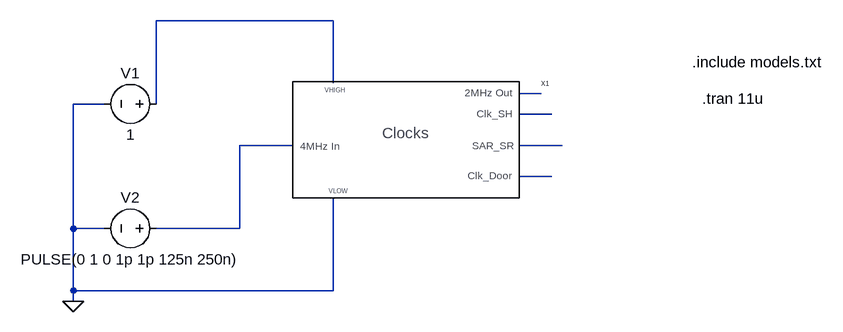
[diagram p0: schematic clocks_test.asc]
clocks_test.asc, the LTspice schematic file:
Version 4
SHEET 1 888 680
WIRE 112 16 -160 16
WIRE 112 112 112 16
WIRE 432 128 400 128
WIRE -240 144 -288 144
WIRE -160 144 -160 16
WIRE 448 160 400 160
WIRE 48 208 -32 208
WIRE 464 208 400 208
WIRE 448 256 400 256
WIRE -288 336 -288 144
WIRE -240 336 -288 336
WIRE -32 336 -32 208
WIRE -32 336 -160 336
WIRE -288 432 -288 336
WIRE 112 432 112 288
WIRE 112 432 -288 432
WIRE -288 448 -288 432
FLAG -288 448 0
SYMBOL Clock_half 160 176 R0
SYMATTR InstName X1
SYMBOL voltage -144 144 R90
WINDOW 0 -32 56 VBottom 2
WINDOW 3 32 56 VTop 2
WINDOW 123 0 0 Left 0
WINDOW 39 0 0 Left 0
SYMATTR InstName V1
SYMATTR Value 1
SYMBOL voltage -144 336 R90
WINDOW 0 -32 56 VBottom 2
WINDOW 3 32 56 VTop 2
WINDOW 123 0 0 Left 0
WINDOW 39 0 0 Left 0
SYMATTR InstName V2
SYMATTR Value PULSE(0 1 0 1p 1p 125n 250n)
TEXT 664 80 Left 2 !.include models.txt
TEXT 680 136 Left 2 !.tran 11u

The netlist it stands for:
* clocks_test.asc
XX1 N001 0 N003 N005 N006 N004 N002 Clock_half  ; pins VHIGH VLOW Clk_SH SAR_SR clk_door clk_in clk_2MHz
V1 N001 0 1
V2 N004 0 PULSE(0 1 0 1p 1p 125n 250n)
.include models.txt
.tran 11u
.backanno
.end